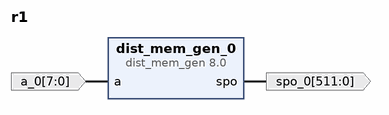
[diagram p0: block diagram of the top level]
# Vivado block design r1, xc7z020clg400-2, Vivado 2018.2
create_bd_design r1

create_bd_port -dir O -from 511 -to 0 spo_0
create_bd_port -dir I -from 7 -to 0 a_0

create_bd_cell -type ip -vlnv xilinx.com:ip:dist_mem_gen:8.0 dist_mem_gen_0
set_property -dict [list \
  CONFIG.depth 256 \
  CONFIG.data_width 512 \
  CONFIG.memory_type rom \
  CONFIG.coefficient_file ../../../../../../reading_data.coe \
] [get_bd_cells dist_mem_gen_0]

# ---- connections ----

connect_bd_net [get_bd_pins dist_mem_gen_0/spo] [get_bd_ports spo_0]
connect_bd_net -net a_0_1 [get_bd_ports a_0] [get_bd_pins dist_mem_gen_0/a]

validate_bd_design
save_bd_design
